# Altium schematic sheet voltage_regulation.SchDoc
size A4
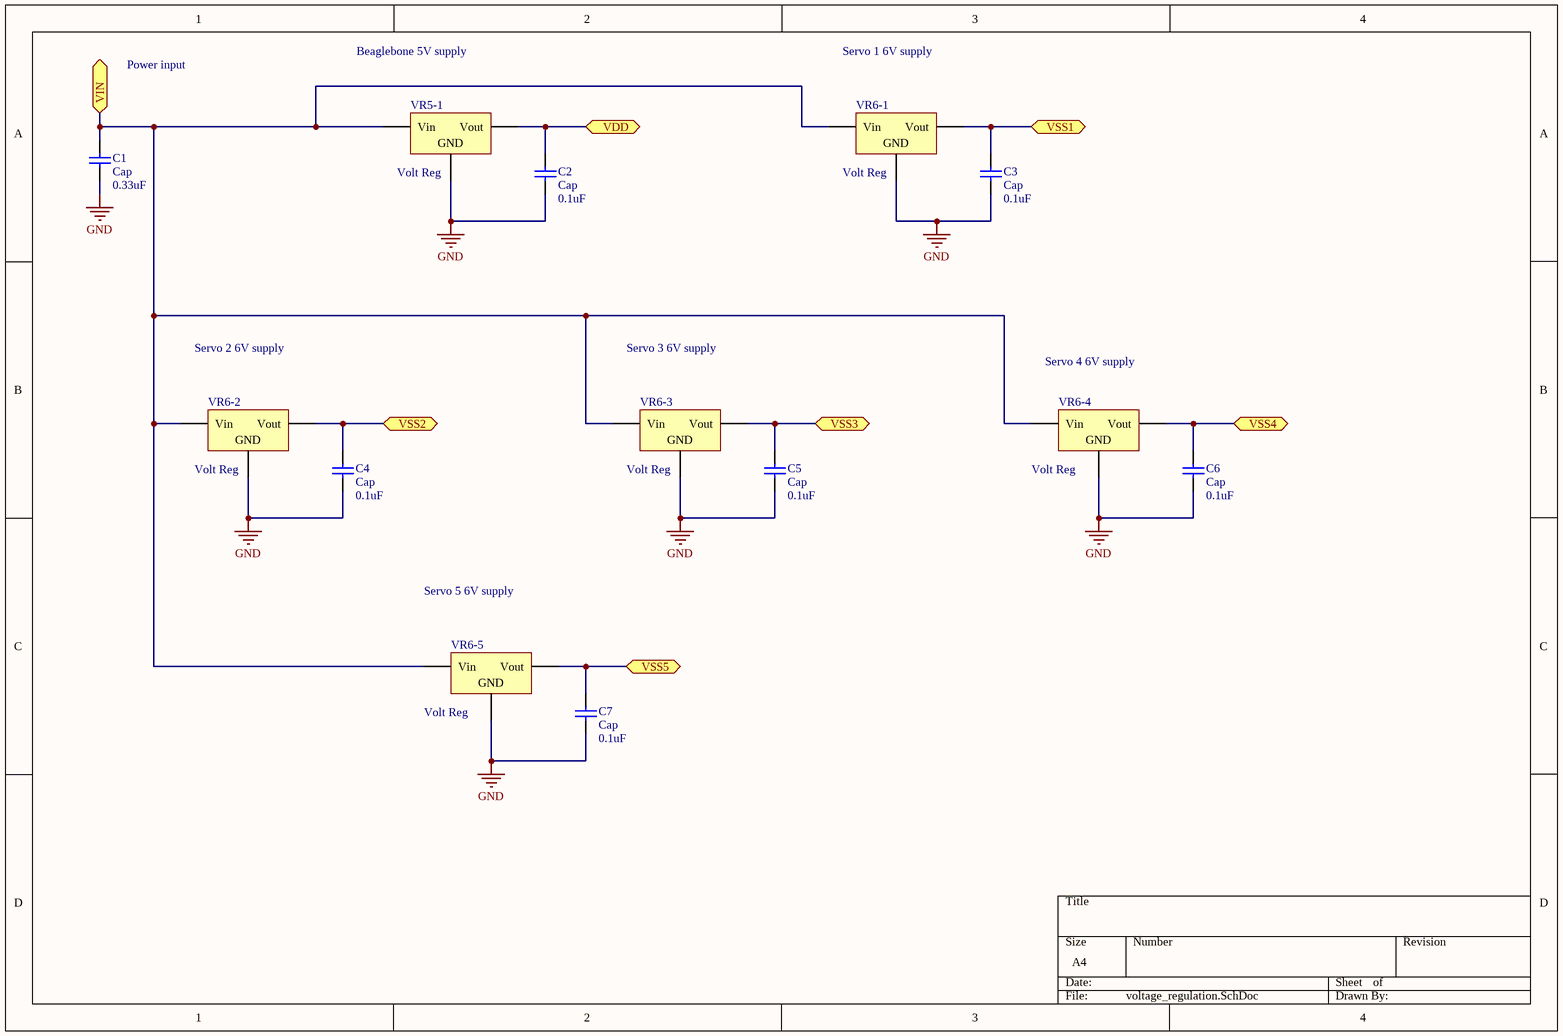
[diagram p0: voltage_regulation.SchDoc]

## Parts
C1  Cap  value 0.33uF  [RAD-0.3]
C2  Cap  value 0.1uF  [RAD-0.3]
C3  Cap  value 0.1uF  [RAD-0.3]
C4  Cap  value 0.1uF  [RAD-0.3]
C5  Cap  value 0.1uF  [RAD-0.3]
C6  Cap  value 0.1uF  [RAD-0.3]
C7  Cap  value 0.1uF  [RAD-0.3]
VR5-1  Volt Reg  [D2PAK_N]
VR6-1  Volt Reg  [D2PAK_N]
VR6-2  Volt Reg  [D2PAK_N]
VR6-3  Volt Reg  [D2PAK_N]
VR6-4  Volt Reg  [D2PAK_N]
VR6-5  Volt Reg  [D2PAK_N]

## Ports
VDD, VIN, VSS1, VSS2, VSS3, VSS4, VSS5

## Nets
GND: C1.1 C2.1 C3.1 C4.1 C5.1 C6.1 C7.1 VR5-1.2(GND) VR6-1.2(GND) VR6-2.2(GND) VR6-3.2(GND) VR6-4.2(GND) VR6-5.2(GND)
VDD: C2.2 VR5-1.3(Vout) ; port VDD
VIN: C1.2 VR5-1.1(Vin) VR6-1.1(Vin) VR6-2.1(Vin) VR6-3.1(Vin) VR6-4.1(Vin) VR6-5.1(Vin) ; port VIN
VSS1: C3.2 VR6-1.3(Vout) ; port VSS1
VSS2: C4.2 VR6-2.3(Vout) ; port VSS2
VSS3: C5.2 VR6-3.3(Vout) ; port VSS3
VSS4: C6.2 VR6-4.3(Vout) ; port VSS4
VSS5: C7.2 VR6-5.3(Vout) ; port VSS5

## Notes on the sheet
- Power input
- Beaglebone 5V supply
- Servo 1 6V supply
- Servo 2 6V supply
- Servo 3 6V supply
- Servo 4 6V supply
- Servo 5 6V supply

## Library data of the parts
C1-C7 = Cap: Capacitor; Published: 8-Jun-2000; LatestRevisionDate: 17-Jul-2002; LatestRevisionNote: Re-released for DXP Platform.; PackageReference: RAD-0.3; Publisher: Altium Limited; PackageDescription: Radial Cap, Thru-Hole; 2 Leads; 0.3 in Pin Spacing
VR5-1 VR6-1-VR6-5 = Volt Reg: Voltage Regulator; Published: 24-Mar-1999; LatestRevisionDate: 29-May-2009; LatestRevisionNote: IPC-7351 Footprint Added.; PackageReference: D2PAK; Publisher: Altium Limited; PackageDescription: 3-Pin Transistor Outline Package 2.54 mm Pitch, 15.1 mm Lead Span